# EasyEDA schematic SCH_laptrinhoto_2025-12-04.json
TITLE: Sheet_1; REV: 1.0; Date: 2025-12-03; Sheet: 1/1; Drawn By: duynguyenquang12; Company: Your Company
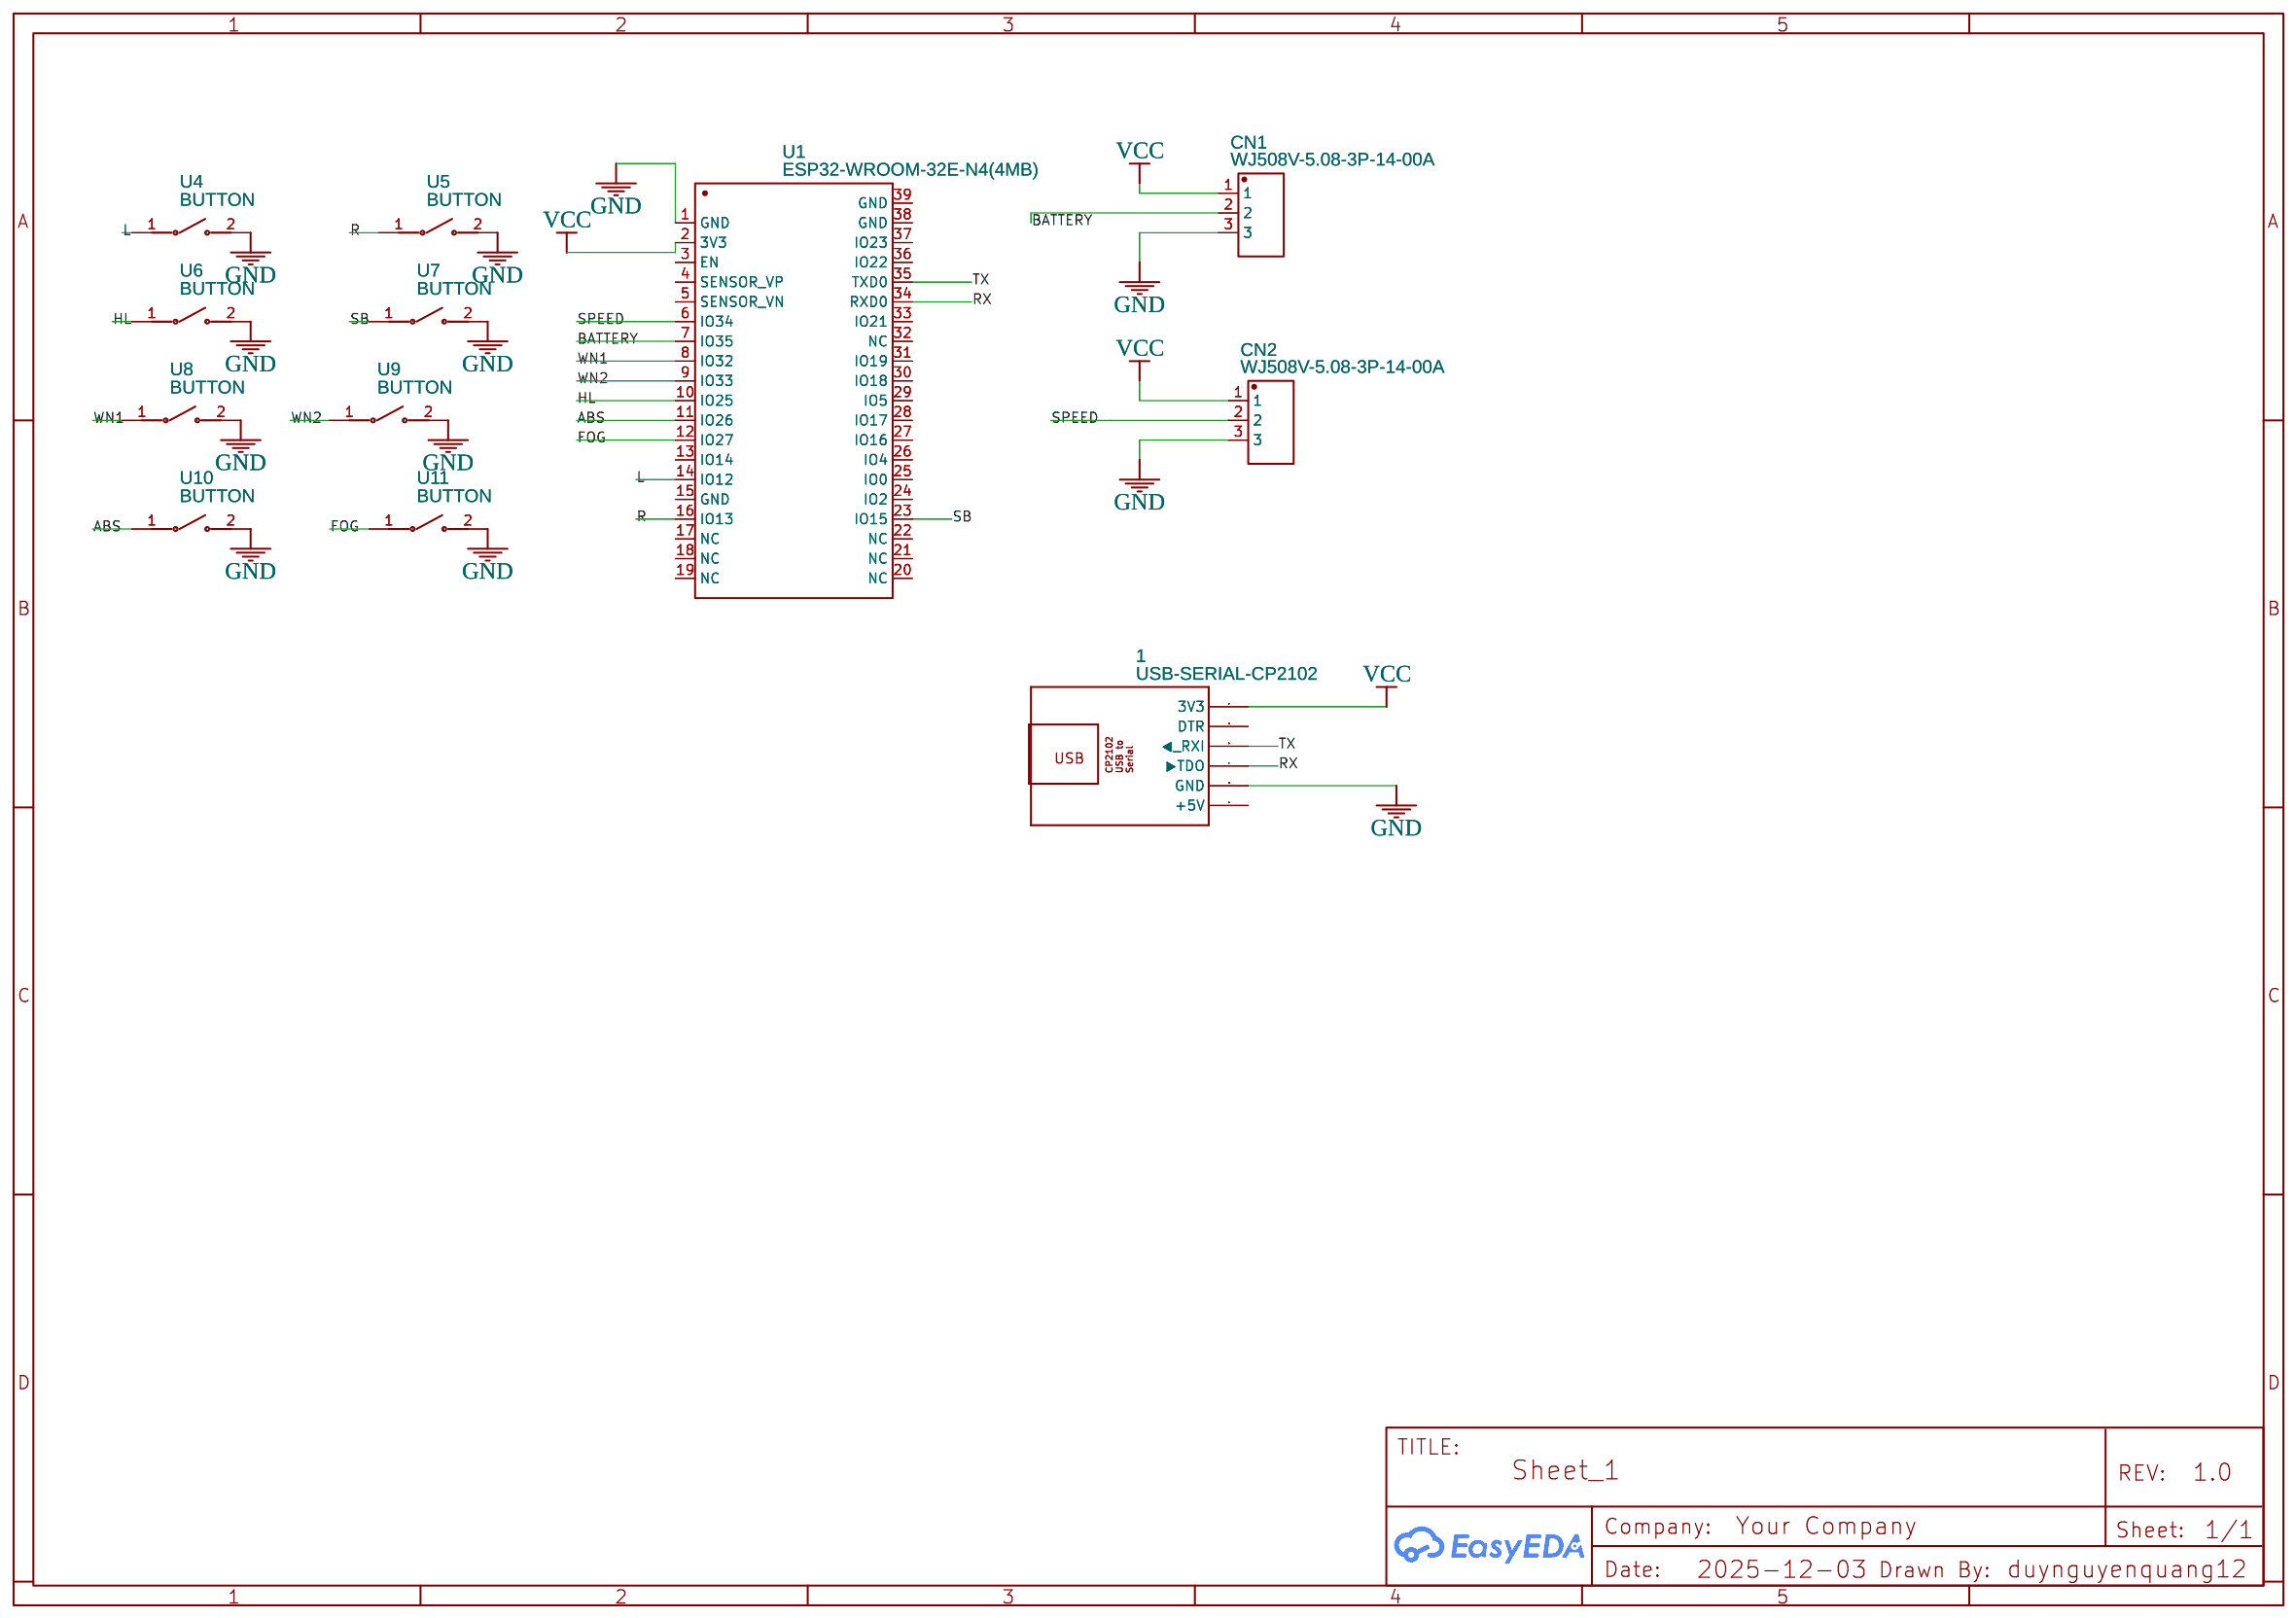
[diagram p0: schematic sheet]

## Parts
1  USB-SERIAL-CP2102  [CP2102 HW-199 RSB]
CN1  WJ508V-5.08-3P-14-00A  [CONN-TH_3P-P5.08_WJ508V-5.08-3P-14-00A]
CN2  WJ508V-5.08-3P-14-00A  [CONN-TH_3P-P5.08_WJ508V-5.08-3P-14-00A]
U1  ESP32-WROOM-32E-N4(4MB)  [WIFI-SMD_ESP32-WROOM-32E-A]
U4  BUTTON  [SW-SMD_L3.9-W2.9-LS4.9-L]
U5  BUTTON  [SW-SMD_L3.9-W2.9-LS4.9-L]
U6  BUTTON  [SW-SMD_L3.9-W2.9-LS4.9-L]
U7  BUTTON  [SW-SMD_L3.9-W2.9-LS4.9-L]
U8  BUTTON  [SW-SMD_L3.9-W2.9-LS4.9-L]
U9  BUTTON  [SW-SMD_L3.9-W2.9-LS4.9-L]
U10  BUTTON  [SW-SMD_L3.9-W2.9-LS4.9-L]
U11  BUTTON  [SW-SMD_L3.9-W2.9-LS4.9-L]

## Library data of the parts
1 = USB-SERIAL-CP2102: Contributor: ralphbacon
CN1 CN2 = WJ508V-5.08-3P-14-00A: Contributor: LCSC; Supplier: LCSC; Manufacturer: ReliaPro; Supplier Part: C58323
U1 = ESP32-WROOM-32E-N4(4MB): Contributor: lcsc; Supplier: LCSC; Supplier Part: C7463334; Manufacturer: null; JLCPCB Part Class: Extended Part
U4-U11 = BUTTON: Contributor: lcsc; Supplier: LCSC; Supplier Part: C9900015607; Manufacturer: null; JLCPCB Part Class: Extended Part

## Nets
GND: 1.5(GND) CN1.3 CN2.3 U1.1(GND) U4.2 U5.2 U6.2 U7.2 U8.2 U9.2 U10.2 U11.2
VCC: 1.1(3V3) CN1.1 CN2.1 U1.2(3V3)
ABS: U1.11(IO26) U10.1
BATTERY: CN1.2 U1.7(IO35)
FOG: U1.12(IO27) U11.1
HL: U1.10(IO25) U6.1
L: U1.14(IO12) U4.1
R: U1.16(IO13) U5.1
RX: 1.4(▶TDO) U1.34(RXD0)
SB: U1.23(IO15) U7.1
SPEED: CN2.2 U1.6(IO34)
TX: 1.3(◀ RXI) U1.35(TXD0)
WN1: U1.8(IO32) U8.1
WN2: U1.9(IO33) U9.1

Not connected (* = marked no-connect by the designer): 1 2(DTR) 6(+5V); U1 3(EN) 4(SENSOR_VP) 5(SENSOR_VN) 13(IO14) 15(GND) 17(NC) 18(NC) 19(NC) 20(NC) 21(NC) 22(NC) 24(IO2) 25(IO0) 26(IO4) 27(IO16) 28(IO17) 29(IO5) 30(IO18) 31(IO19) 32(NC) 33(IO21) 36(IO22) 37(IO23) 38(GND) 39(GND)
